# EasyEDA Pro project ProProject_3StepperShield_2024-04-21.epro

# Schematic ssss
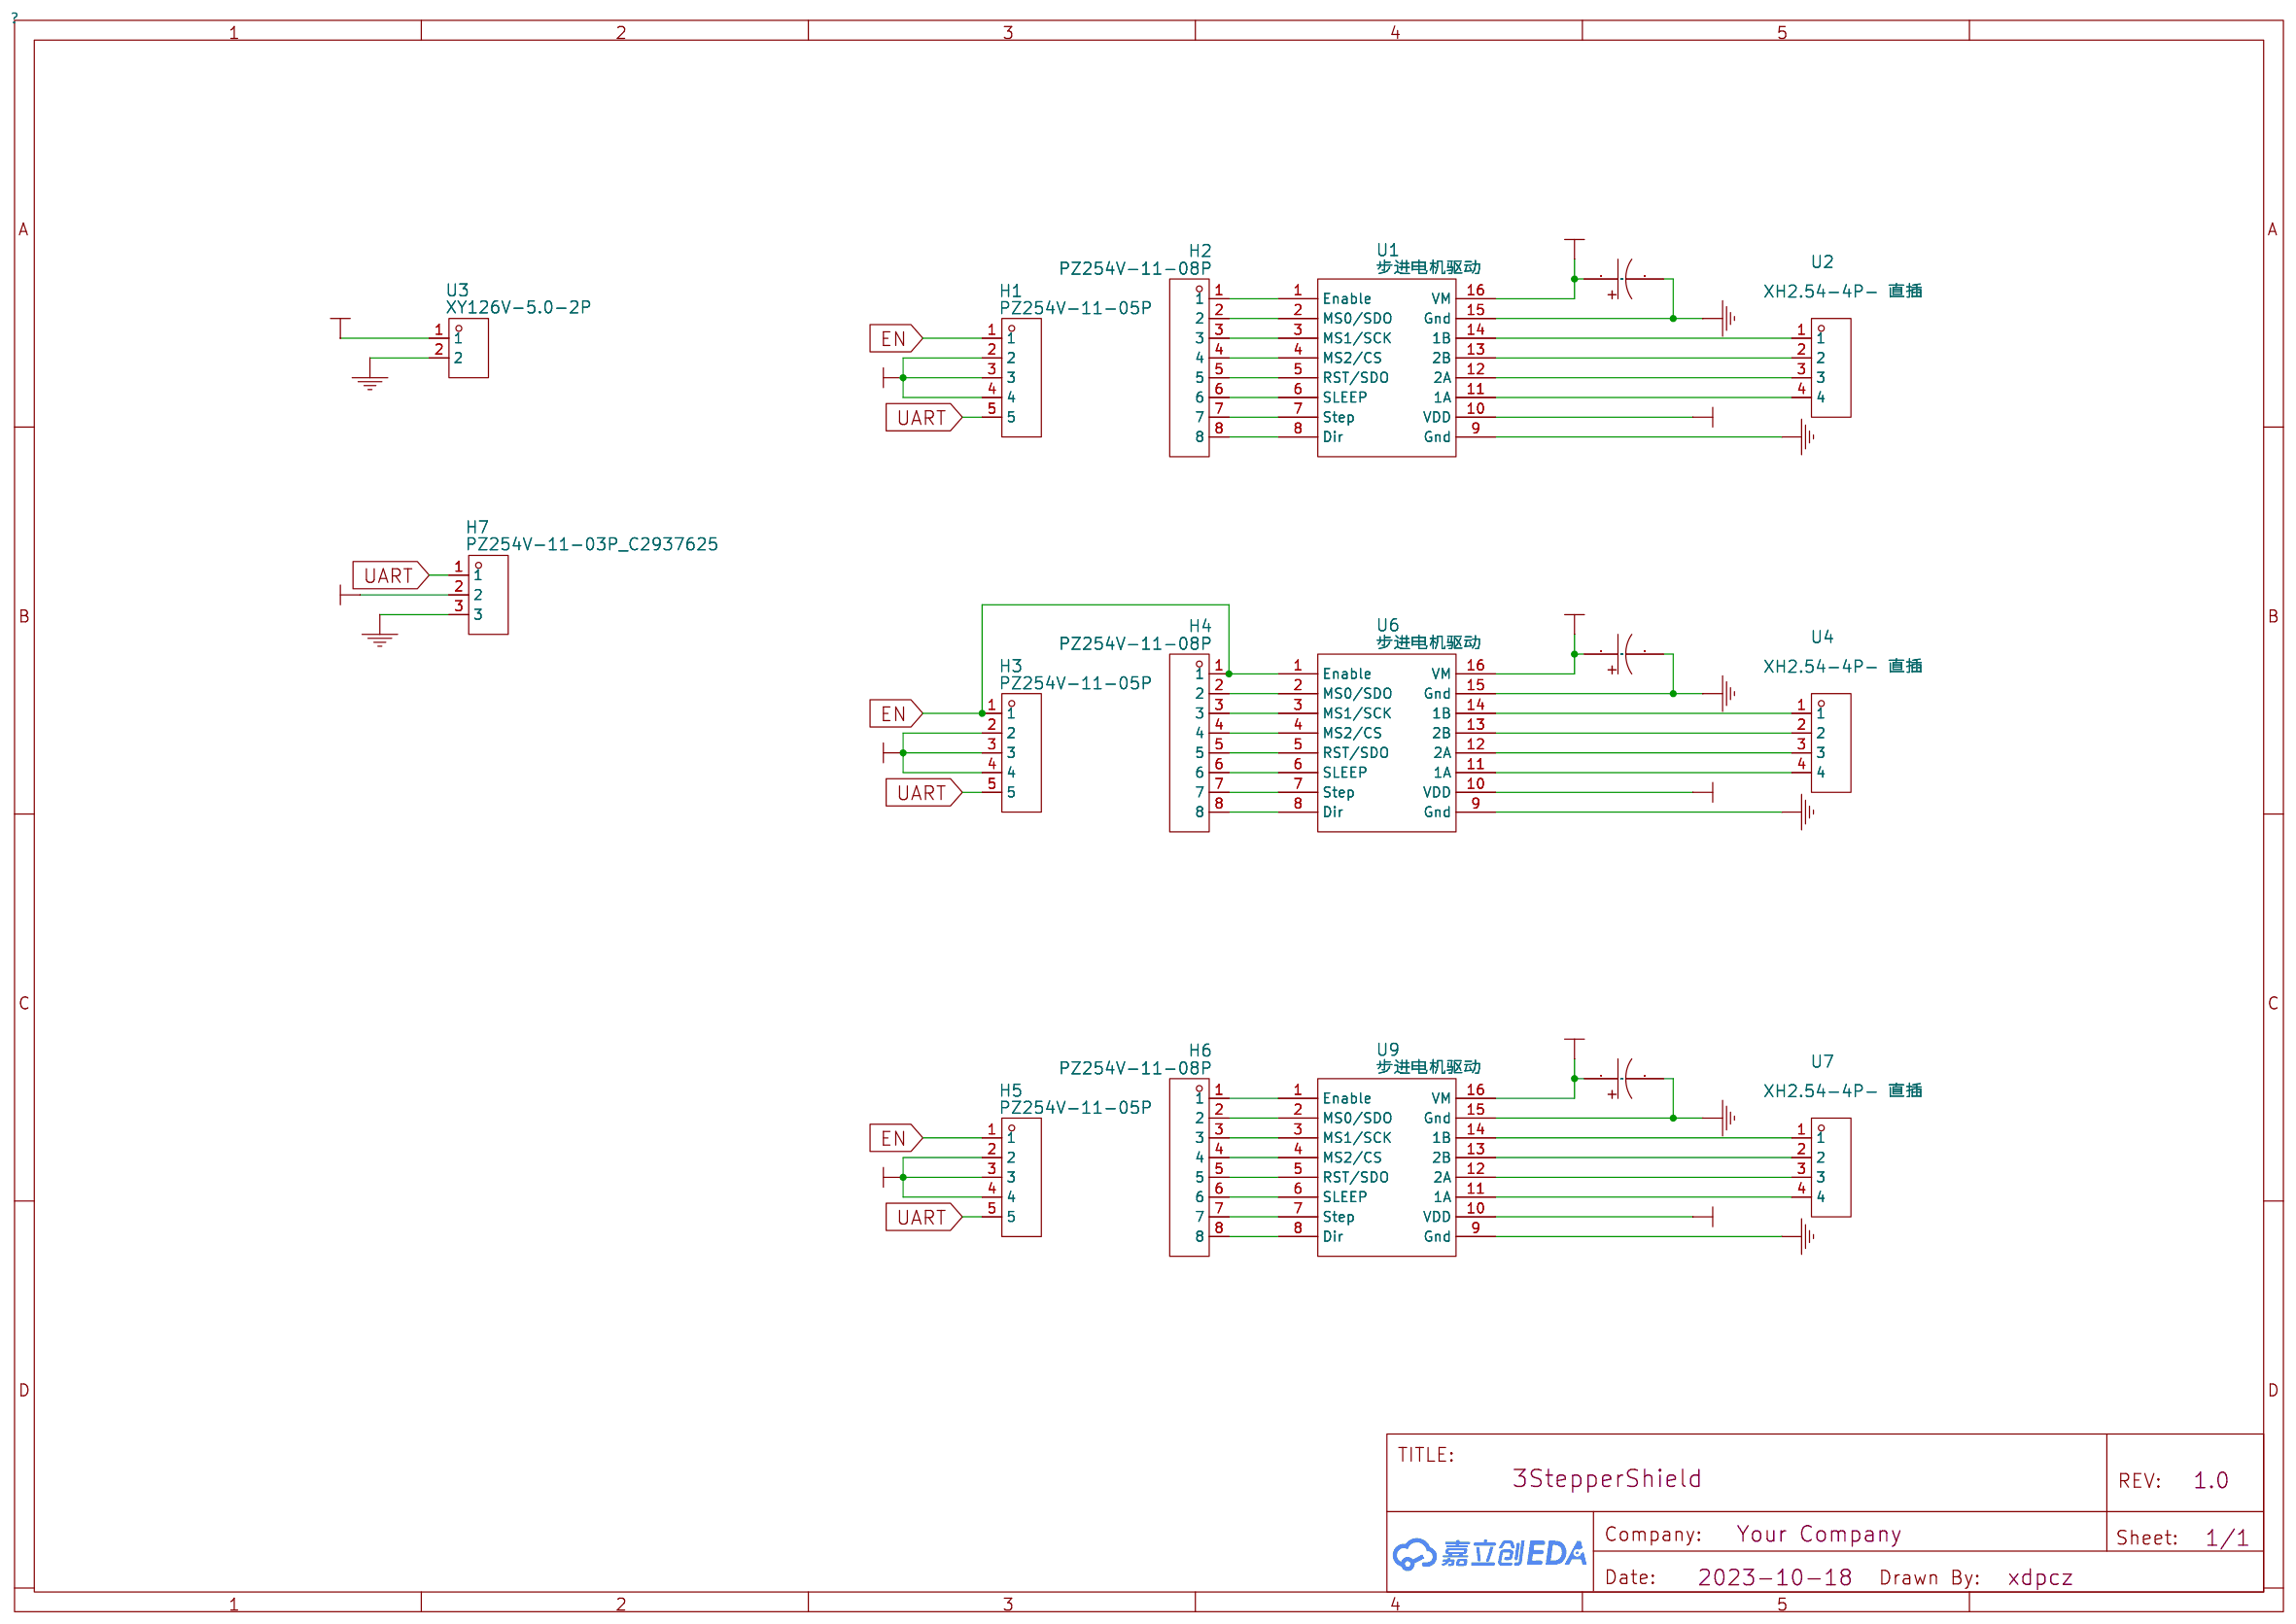
[diagram p0: schematic sheet]

## Parts
H1  PZ254V-11-05P  [HDR-TH_5P-P2.54-V-M]
H2  PZ254V-11-08P  [HDR-TH_8P-P2.54-V-M]
H3  PZ254V-11-05P  [HDR-TH_5P-P2.54-V-M]
H4  PZ254V-11-08P  [HDR-TH_8P-P2.54-V-M]
H5  PZ254V-11-05P  [HDR-TH_5P-P2.54-V-M]
H6  PZ254V-11-08P  [HDR-TH_8P-P2.54-V-M]
H7  PZ254V-11-03P_C2937625  [HDR-TH_3P-P2.54-V-M]
U1  步进电机驱动  [TMC2209N_D]
U2  XH2.54-4P- 直插  [CONN-TH_4P-P2.50-XH2.54-4P]
U3  XY126V-5.0-2P  [CONN-TH_XY126V-5.0-2P]
U4  XH2.54-4P- 直插  [CONN-TH_4P-P2.50-XH2.54-4P]
U5  贴片铝电解电容100UF,20%,35V,6.3*7.7  [CAP-SMD_BD6.3-L6.6-W6.6-LS7.4-FD]
U6  步进电机驱动  [TMC2209N_D]
U7  XH2.54-4P- 直插  [CONN-TH_4P-P2.50-XH2.54-4P]
U8  贴片铝电解电容100UF,20%,35V,6.3*7.7  [CAP-SMD_BD6.3-L6.6-W6.6-LS7.4-FD]
U9  步进电机驱动  [TMC2209N_D]
U13  贴片铝电解电容100UF,20%,35V,6.3*7.7  [CAP-SMD_BD6.3-L6.6-W6.6-LS7.4-FD]

## Library data of the parts
H1 = PZ254V-11-08P: link: https://so.szlcsc.com/global.html?k=C492404amp;ref=editor; 3DModel: HDR-TH_5P-P2.54-M-LI-1X5P; Supplier: LCSC; Supplier Part: C492404; Manufacturer: XFCN(兴飞); JLCPCB Part Class: Extended Part
H2 H4 H6 = PZ254V-11-08P: link: https://so.szlcsc.com/global.html?k=C492407amp;ref=editor; Supplier: LCSC; Supplier Part: C492407; Manufacturer: XFCN(兴飞); JLCPCB Part Class: Extended Part
H3 H5 = PZ254V-11-05P: link: https://so.szlcsc.com/global.html?k=C492404amp;ref=editor; 3DModel: HDR-TH_5P-P2.54-M-LI-1X5P; Supplier: LCSC; Supplier Part: C492404; Manufacturer: XFCN(兴飞); JLCPCB Part Class: Extended Part
H7 = PZ254V-11-03P_C2937625: link: https://so.szlcsc.com/global.html?k=C2937625amp;ref=editor; 3DModel: HDR-TH_3P-P2.54-M-LI-1X3P; Supplier: LCSC; Supplier Part: C2937625; Manufacturer: XFCN(兴飞); Manufacturer Part: PZ254V-11-03P; JLCPCB Part Class: Extended Part
U1 U6 U9 = 步进电机驱动
U2 U4 U7 = XH2.54-4P- 直插: link: https://img.jlc.com/pdf/applyPasteComponent/2021-09-13/837084A/aaafcbedaa1341f78bdd46f8ab13ab21/XH2_54datasheet.pdf; Supplier: LCSC; Supplier Part: C9900000103; Manufacturer: null; JLCPCB Part Class: Extended Part
U3 = XY126V-5.0-2P: link: https://so.szlcsc.com/global.html?k=C557646amp;ref=editor; Supplier: LCSC; Supplier Part: C557646; Manufacturer: XINLAIYA(新莱亚); JLCPCB Part Class: Extended Part
U5 U8 U13 = 贴片铝电解电容100UF,20%,35V,6.3*7.7: link: https://atta.szlcsc.com/upload/public/pdf/source/20180808/C264245_8FD733298A1E25EA9CE07F21A611B6A1.pdf; Supplier: LCSC; Supplier Part: C9900003690; Manufacturer: null; Manufacturer Part: 贴片铝电解电容100uF,20%,35V,6.3*7.7; JLCPCB Part Class: Extended Part

## Nets
GND: H7.3 U1.9(Gnd) U1.15(Gnd) U3.2 U5.2 U6.9(Gnd) U6.15(Gnd) U8.2 U9.9(Gnd) U9.15(Gnd) U13.2
VCC: U1.16(VM) U3.1 U5.1 U6.16(VM) U8.1 U9.16(VM) U13.1
VDD: H1.2 H1.3 H1.4 H3.2 H3.3 H3.4 H5.2 H5.3 H5.4 H7.2 U1.10(VDD) U6.10(VDD) U9.10(VDD)
EN: H1.1 H3.1 H4.1 H5.1 U6.1(Enable)
UART: H1.5 H3.5 H5.5 H7.1
$1N74: U1.14(1B) U2.1
$1N75: U1.13(2B) U2.2
$1N76: U1.12(2A) U2.3
$1N77: U1.11(1A) U2.4
$1N102: H2.1 U1.1(Enable)
$1N103: H2.2 U1.2(MS0/SDO)
$1N104: H2.3 U1.3(MS1/SCK)
$1N105: H2.4 U1.4(MS2/CS)
$1N106: H2.5 U1.5(RST/SDO)
$1N107: H2.6 U1.6(SLEEP)
$1N108: H2.7 U1.7(Step)
$1N109: H2.8 U1.8(Dir)
$1N172: H4.8 U6.8(Dir)
$1N173: H4.7 U6.7(Step)
$1N174: H4.6 U6.6(SLEEP)
$1N175: H4.5 U6.5(RST/SDO)
$1N176: H4.4 U6.4(MS2/CS)
$1N177: H4.3 U6.3(MS1/SCK)
$1N178: H4.2 U6.2(MS0/SDO)
$1N204: U4.4 U6.11(1A)
$1N205: U4.3 U6.12(2A)
$1N206: U4.2 U6.13(2B)
$1N207: U4.1 U6.14(1B)
$1N280: H6.8 U9.8(Dir)
$1N281: H6.7 U9.7(Step)
$1N282: H6.6 U9.6(SLEEP)
$1N283: H6.5 U9.5(RST/SDO)
$1N284: H6.4 U9.4(MS2/CS)
$1N285: H6.3 U9.3(MS1/SCK)
$1N286: H6.2 U9.2(MS0/SDO)
$1N287: H6.1 U9.1(Enable)
$1N312: U7.4 U9.11(1A)
$1N313: U7.3 U9.12(2A)
$1N314: U7.2 U9.13(2B)
$1N315: U7.1 U9.14(1B)

# Board 1-PCB_PCB_ssss_3
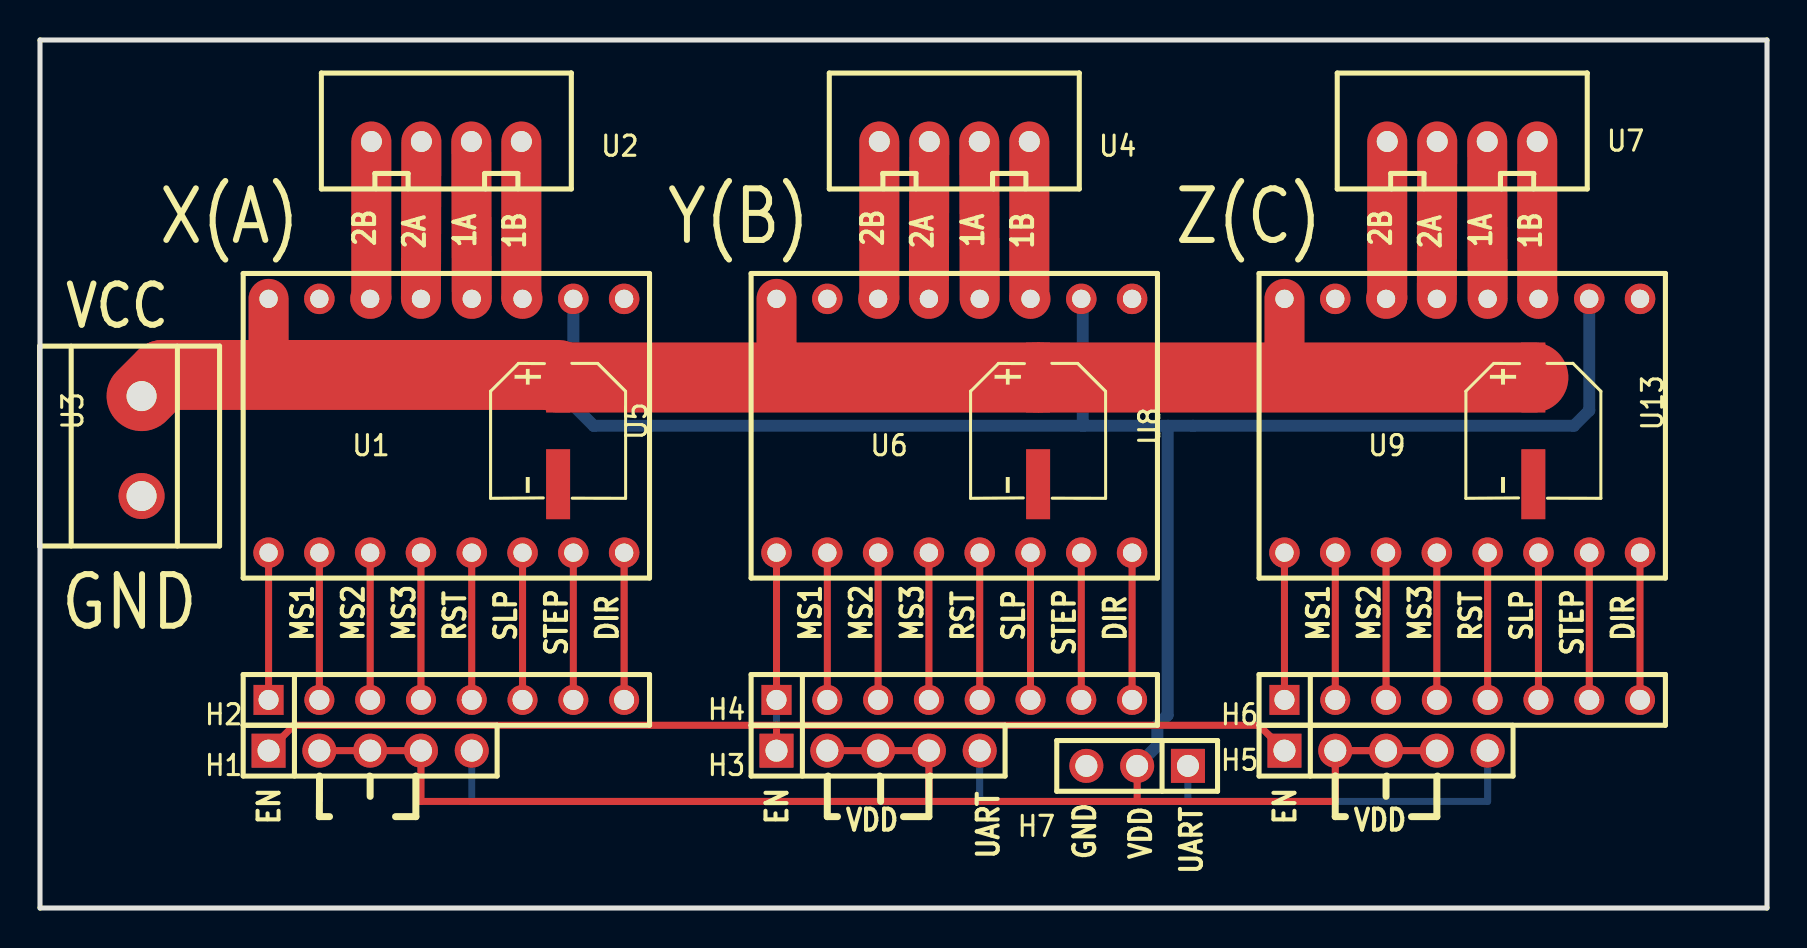
[diagram p1: board, top side]
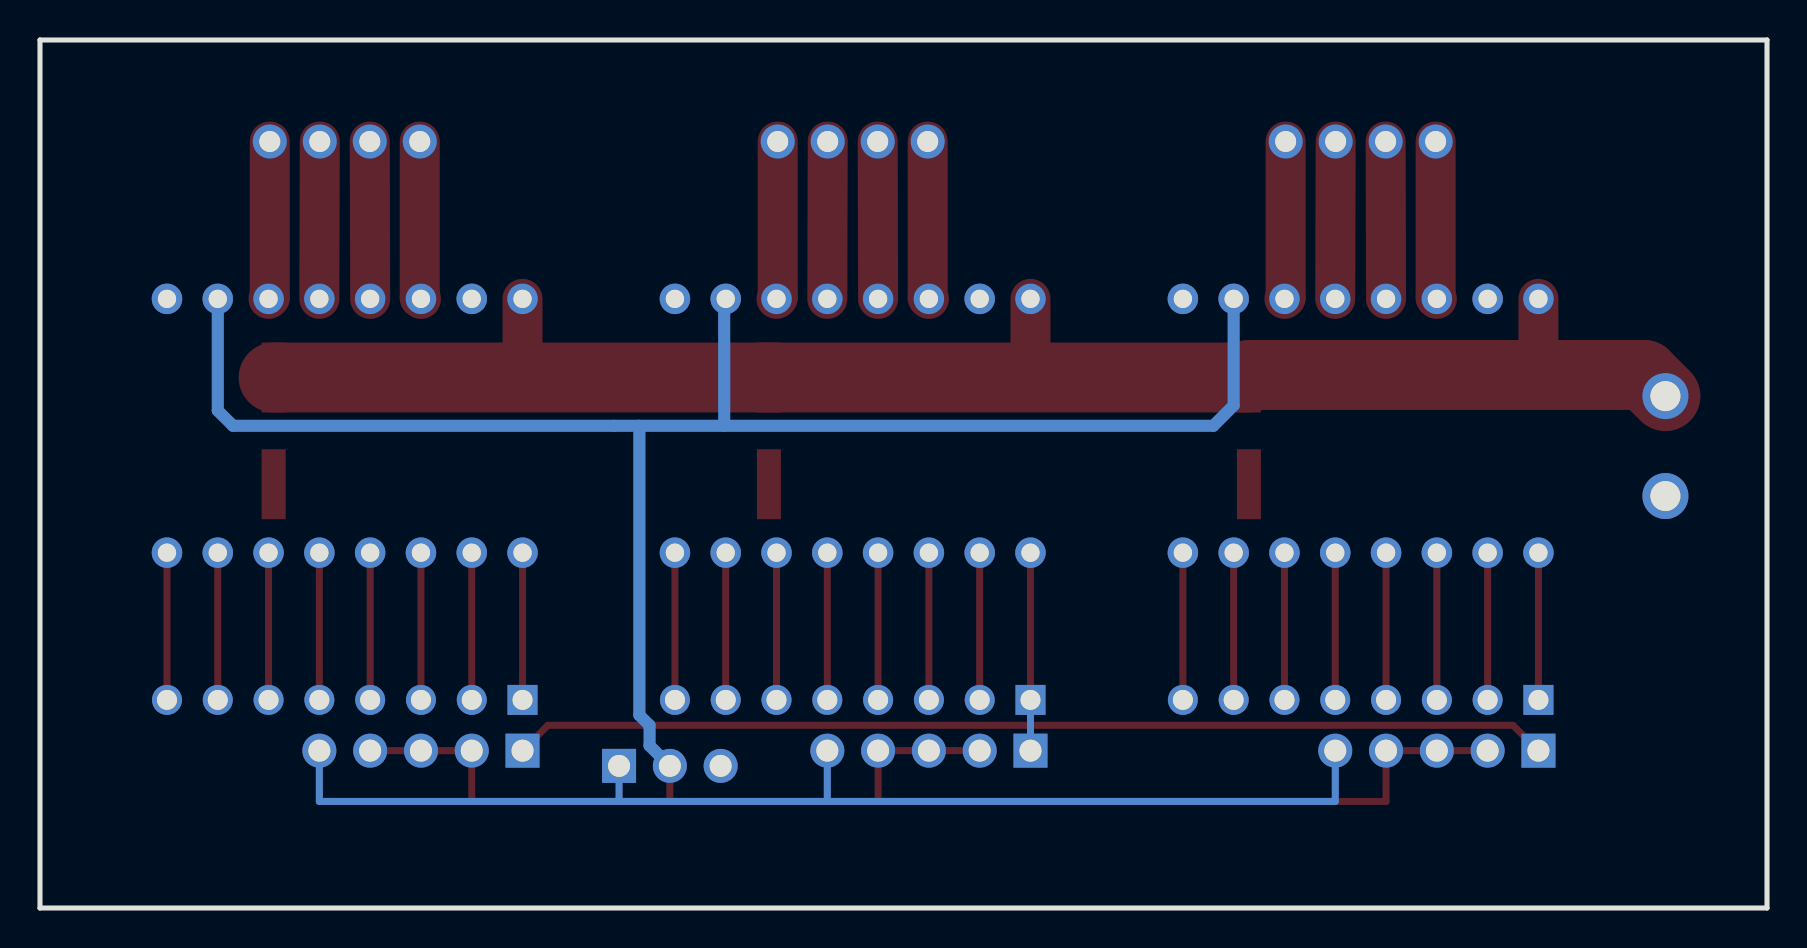
[diagram p2: board, bottom side, seen from below]

Outline 86.36 x 43.43 mm; copper layers: Top Layer, Inner1, Inner2, Inner3, Inner4, Inner5, Inner6, Inner7, Inner8, Inner9, Inner10, Inner11, Inner12, Inner13, Inner14, Inner15, Inner16, Inner17, Inner18, Inner19, Inner20, Inner21, Inner22, Inner23, Inner24, Inner25, Inner26, Inner27, Inner28, Inner29, Inner30, Bottom Layer. Coordinates in mm from the lower left corner of the outline.
Outline path: 0,43.43 86.36,43.43 86.36,0 0,0 0,43.43
Stack: Top Layer 0.035mm / Dielectric1 1.51mm FR4 er 4.5 / Bottom Layer 0.035mm

## Design rules (mm)
spacing Default (default): track to track 0.152, other pairs 0 to 0.152
track width Default (default): min 0.254, default 0.254, max 25.4
differential pair differentialPair (default): width min 0.127, default 0.254, max 2.54; gap min 0.152, default 0.152
via Default (default): diameter min 0.61, default 0.61, max 100.025; hole min 0.305, default 0.305, max 59.995
net GND uses gge5652(1)
pour e20 uses gge5607
pour e21 uses gge5607
pour e90 uses gge5652
pour e91 uses gge5652(1)

## Placement (name value [footprint] x y rotation side)
H1  PZ254V-11-05P  [HDR-TH_5P-P2.54-V-M]  16.51 7.87 0 top
H2  PZ254V-11-08P  [HDR-TH_8P-P2.54-V-M]  20.32 10.41 0 top
H3  PZ254V-11-05P  [HDR-TH_5P-P2.54-V-M]  41.91 7.87 0 top
H4  PZ254V-11-08P  [HDR-TH_8P-P2.54-V-M]  45.72 10.41 0 top
H5  PZ254V-11-05P  [HDR-TH_5P-P2.54-V-M]  67.31 7.87 0 top
H6  PZ254V-11-08P  [HDR-TH_8P-P2.54-V-M]  71.12 10.41 0 top
H7  PZ254V-11-03P_C2937625  [HDR-TH_3P-P2.54-V-M]  54.86 7.11 180 top
U1  步进电机驱动  [TMC2209N_D]  17.65 23.11 90 top
U2  XH2.54-4P- 直插  [CONN-TH_4P-P2.50-XH2.54-4P]  20.32 38.35 180 top
U3  XY126V-5.0-2P  [CONN-TH_XY126V-5.0-2P]  5.08 23.11 270 top
U4  XH2.54-4P- 直插  [CONN-TH_4P-P2.50-XH2.54-4P]  45.72 38.35 180 top
U5  贴片铝电解电容100UF,20%,35V,6.3*7.7  [CAP-SMD_BD6.3-L6.6-W6.6-LS7.4-FD]  25.91 23.88 270 top
U6  步进电机驱动  [TMC2209N_D]  43.05 23.11 90 top
U7  XH2.54-4P- 直插  [CONN-TH_4P-P2.50-XH2.54-4P]  71.12 38.35 180 top
U8  贴片铝电解电容100UF,20%,35V,6.3*7.7  [CAP-SMD_BD6.3-L6.6-W6.6-LS7.4-FD]  49.91 23.88 270 top
U9  步进电机驱动  [TMC2209N_D]  68.45 23.11 90 top
U13  贴片铝电解电容100UF,20%,35V,6.3*7.7  [CAP-SMD_BD6.3-L6.6-W6.6-LS7.4-FD]  74.68 23.88 270 top

## Footprints (pads in the part's own frame, mm; a bottom-side part is the same pattern mirrored in y, then rotated)
CAP-SMD_BD6.3-L6.6-W6.6-LS7.4-FD
  rect 3.5x1.2 smd: 1(-2.67,0) 2(2.67,0)
CONN-TH_4P-P2.50-XH2.54-4P
  round 1.7 hole 1.05: 1(3.75,0) 2(1.25,0) 3(-1.25,0) 4(-3.75,0)
CONN-TH_XY126V-5.0-2P
  round 2.3 hole 1.5: 1(-2.5,0) 2(2.5,0)
HDR-TH_3P-P2.54-V-M
  rect 1.7x1.7 hole 1.1: 1(-2.54,0)
  round 1.7 hole 1.1: 2(0,0) 3(2.54,0)
HDR-TH_5P-P2.54-V-M
  rect 1.7x1.7 hole 1.1: 1(-5.08,0)
  round 1.7 hole 1.1: 2(-2.54,0) 3(0,0) 4(2.54,0) 5(5.08,0)
HDR-TH_8P-P2.54-V-M
  rect 1.5x1.5 hole 1: 1(-8.89,0)
  round 1.5 hole 1: 2(-6.35,0) 3(-3.81,0) 4(-1.27,0) 5(1.27,0) 6(3.81,0) 7(6.35,0) 8(8.89,0)
TMC2209N_D
  round 1.524 hole 0.914: 1(-5.334,6.223) 2(-5.334,3.683) 3(-5.334,1.143) 4(-5.334,-1.397) 5(-5.334,-3.937) 6(-5.334,-6.477) 7(-5.334,-9.017) 8(-5.334,-11.557) 9(7.366,-11.557) 10(7.366,-9.017) 11(7.366,-6.477) 12(7.366,-3.937) 13(7.366,-1.397) 14(7.366,1.143) 15(7.366,3.683) 16(7.366,6.223)

## Nets
As in the schematic.

## Routing (per net, layer and track width the routed paths; a pad name or vN(x,y) marks a point on that pad's centre or on a via; arc(x,y) is an arc through that point)
VCC: length 81.7
  Top Layer w2: U9.16 62.23,26.55 ; U1.16 11.43,26.67 ; U6.16 36.83,26.55
  Top Layer w3.5: U5.1 U8.1 U13.1 ; 25.91,26.67 6.14,26.67 U3.1
VDD: length 159.4
  Top Layer w0.35: H5.3 H5.4 ; H5.3 H5.2 ; H5.3 H5.2 ; 44.45,5.33 19.05,5.33 H1.4 H1.3 H1.2 ; 44.45,5.33 H3.4 H3.3 H3.2 ; 44.45,5.33 54.86,5.33 ; 54.86,5.33 64.77,5.33 H5.2 ; 54.86,5.33 H7.2
  Bottom Layer w0.6: 52.14,24.13 52.14,30.41 U6.10 ; 56.39,24.13 56.39,9.65 55.88,9.14 55.88,8.13 H7.2 ; U1.10 26.67,25.15 27.69,24.13 76.71,24.13 77.47,24.89 U9.10
EN: length 63
  Top Layer w0.35: 36.83,9.14 12.7,9.14 H1.1 ; 36.83,9.14 H3.1 ; 36.83,9.14 60.96,9.14 H5.1 ; H4.1 U6.1
  Bottom Layer w0.35: H4.1 H3.1
UART: length 60.2
  Bottom Layer w0.35: H5.5 72.39,5.33 57.4,5.33 ; H1.5 21.59,5.33 57.4,5.33 ; 57.4,5.33 H7.1 ; H3.5 46.99,5.33
$1N74: length 7.9
  Top Layer w2: U1.14 16.57,30.54 U2.1
$1N75: length 7.9
  Top Layer w2: U2.2 U1.13
$1N76: length 7.9
  Top Layer w2: U2.3 U1.12
$1N77: length 7.9
  Top Layer w2: U2.4 24.07,30.54 U1.11
$1N102: length 7.4
  Top Layer w0.35: H2.1 U1.1
$1N103: length 7.4
  Top Layer w0.35: H2.2 U1.2
$1N104: length 7.4
  Top Layer w0.35: H2.3 U1.3
$1N105: length 7.4
  Top Layer w0.35: H2.4 U1.4
$1N106: length 7.4
  Top Layer w0.35: H2.5 U1.5
$1N107: length 7.4
  Top Layer w0.35: H2.6 U1.6
$1N108: length 7.4
  Top Layer w0.35: H2.7 U1.7
$1N109: length 7.4
  Top Layer w0.35: H2.8 U1.8
$1N172: length 7.4
  Top Layer w0.35: H4.8 U6.8
$1N173: length 7.4
  Top Layer w0.35: H4.7 U6.7
$1N174: length 7.4
  Top Layer w0.35: H4.6 U6.6
$1N175: length 7.4
  Top Layer w0.35: H4.5 U6.5
$1N176: length 7.4
  Top Layer w0.35: H4.4 U6.4
$1N177: length 7.4
  Top Layer w0.35: H4.3 U6.3
$1N178: length 7.4
  Top Layer w0.35: H4.2 U6.2
$1N204: length 7.9
  Top Layer w2: U6.11 49.47,30.54 U4.4
$1N205: length 7.9
  Top Layer w2: U4.3 U6.12
$1N206: length 7.9
  Top Layer w2: U4.2 U6.13
$1N207: length 7.9
  Top Layer w2: U4.1 41.97,30.54 U6.14
$1N280: length 7.4
  Top Layer w0.35: H6.8 U9.8
$1N281: length 7.4
  Top Layer w0.35: H6.7 U9.7
$1N282: length 7.4
  Top Layer w0.35: H6.6 U9.6
$1N283: length 7.4
  Top Layer w0.35: H6.5 U9.5
$1N284: length 7.4
  Top Layer w0.35: H6.4 U9.4
$1N285: length 7.4
  Top Layer w0.35: H6.3 U9.3
$1N286: length 7.4
  Top Layer w0.35: H6.2 U9.2
$1N287: length 7.4
  Top Layer w0.35: H6.1 U9.1
$1N312: length 7.9
  Top Layer w2: U9.11 74.87,30.54 U7.4
$1N313: length 7.9
  Top Layer w2: U7.3 U9.12
$1N314: length 7.9
  Top Layer w2: U7.2 U9.13
$1N315: length 7.9
  Top Layer w2: U7.1 67.37,30.54 U9.14

## Copper pours and planes (outline as drawn; the poured copper is in the pictures)
GND on Top Layer: 0,0 0,43.69 0.25,43.43 86.36,43.43 86.36,0
GND on Bottom Layer: 0,43.43 86.11,43.43 86.36,43.18 86.36,0.25 86.11,0 0,0

Small or netless copper shapes (teardrops, artwork), in the pictures only: 1 on Top Layer

## Text on the board
Top Silkscreen Layer: VDD | EN | MS1 | MS2 | 2B | MS3 | 2A | RST | 1A | SLP | 1B | STEP | DIR | UART | GND | VCC | X(A) | Y(B) | Z(C)
